# EAGLE design Single PCB - IRM-10-5 (EAGLE 9.6.2)
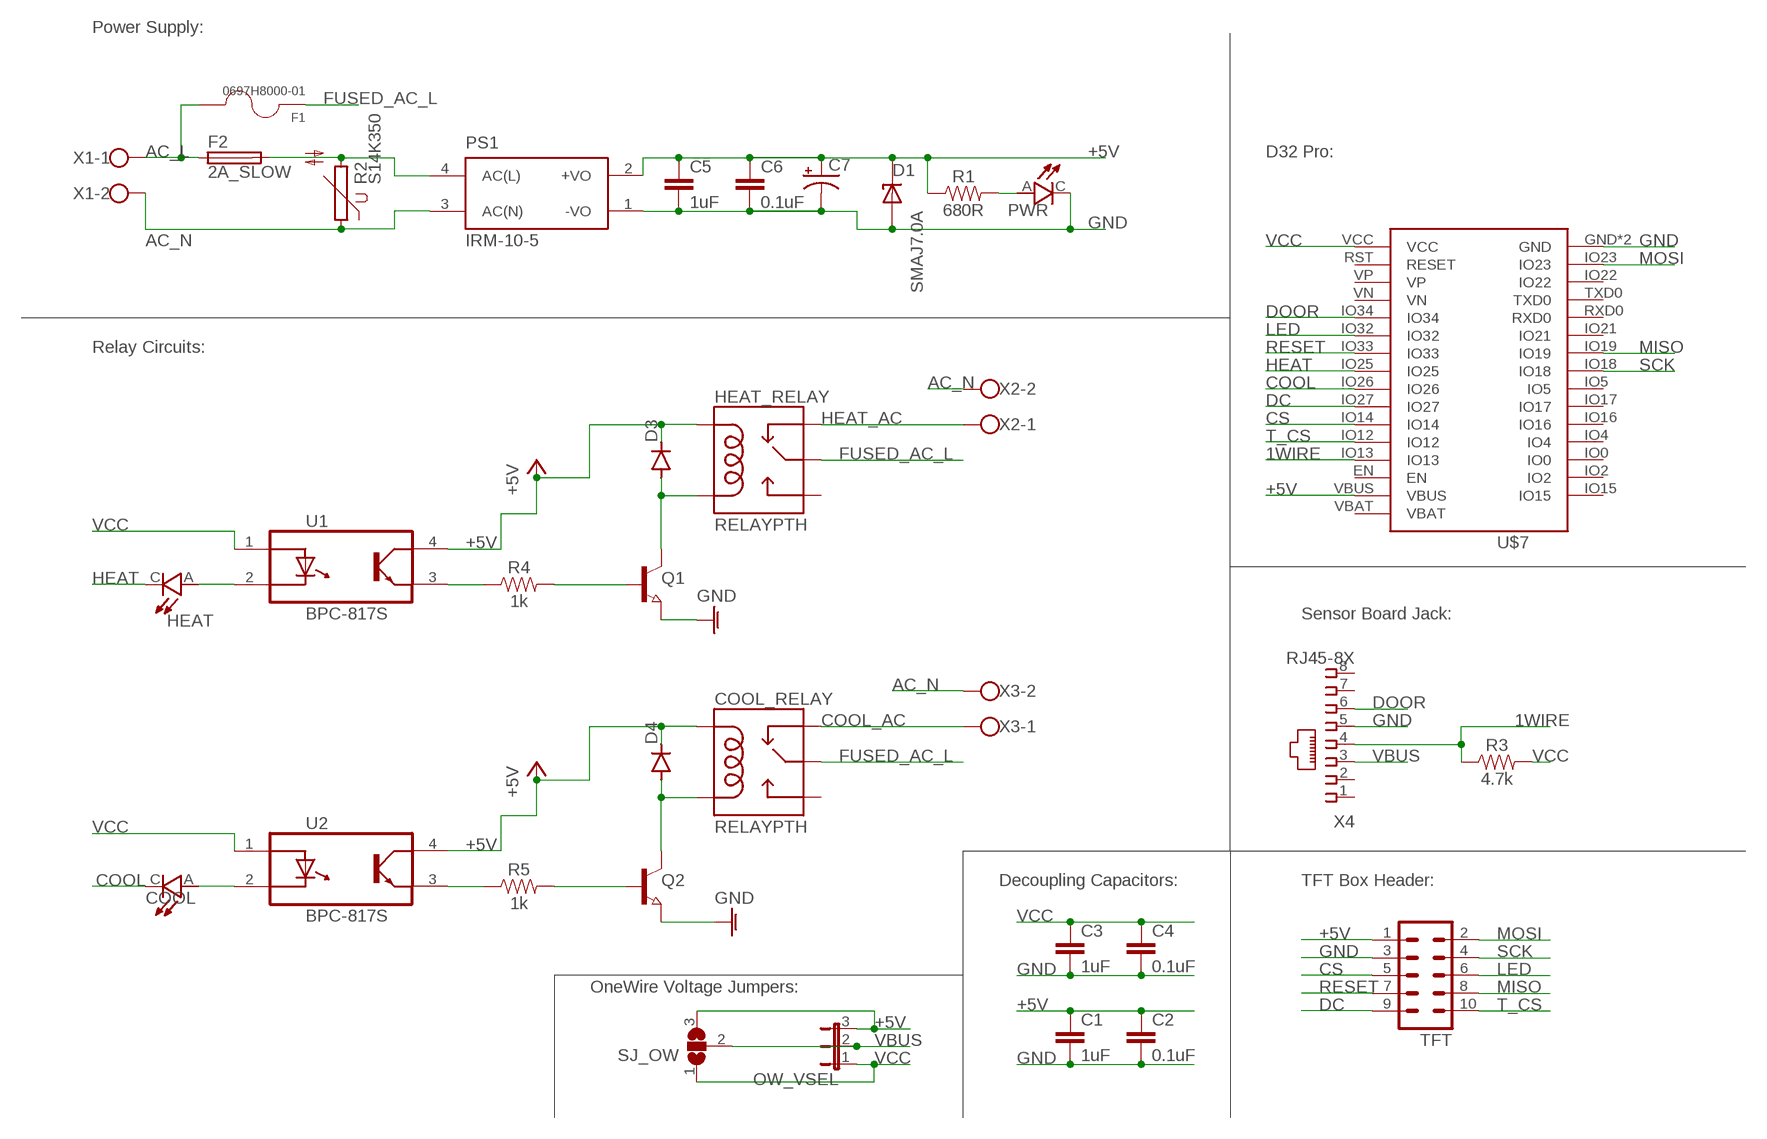
[diagram p0: schematic, sheet 1]

## Parts
C1  1uF  CAP_SMD0805  [SMD-0805]
C2  0.1uF  CAP_SMD0805  [SMD-0805]
C3  1uF  CAP_SMD0805  [SMD-0805]
C4  0.1uF  CAP_SMD0805  [SMD-0805]
C5  1uF  CAP_SMD0805  [SMD-0805]
C6  0.1uF  CAP_SMD0805  [SMD-0805]
C7  220uF  220UF-POLAR220UF  [CAPPRD750W80D1600H2700]
COOL  LED_0603LED_SMD_0603  [LED_SMD_0603]
COOL_RELAY  RELAYPTH  [SRD-05VDC-SL-C]
D1  SMAJ7.0A  [DIOM4325X250N]
D3  DIODE-DO214AC  [DO214AC]
D4  DIODE-DO214AC  [DO214AC]
F1  0697H8000-01  [FUSRR508W60L835T400H810]
F2  2A_SLOW  FUSEFUSE_85_43  [FUSE_BK/PCE-5-R]
HEAT  LED_0603LED_SMD_0603  [LED_SMD_0603]
HEAT_RELAY  RELAYPTH  [SRD-05VDC-SL-C]
OW_VSEL  JP2ENOLABEL  [JP2-NOLABEL]
PS1  IRM-10-5  IRM-10-5-JB  [IRM-10_MWU]
PWR  LED_0603LED_SMD_0603  [LED_SMD_0603]
Q1  NPN-TRANSISTOR_SOT23  [SOT23]
Q2  NPN-TRANSISTOR_SOT23  [SOT23]
R1  680R  RES_SMD0805  [SMD-0805]
R2  S14K350  S10K350  [S10K350]
R3  4.7k  RES_SMD0805  [SMD-0805]
R4  1k  RES_SMD0805  [SMD-0805]
R5  1k  RES_SMD0805  [SMD-0805]
SJ_OW  SJ2W  [SJ_2]
TFT  MA05-2  [MA05-2]
U1  BPC-817S  [SOIC127P700X210-4N]
U2  BPC-817S  [SOIC127P700X210-4N]
U$7  WEMOS-D32D32_PRO_NO-KEEPOUT  [D32_PRO_NO-KEEPOUT]
X1  W237-102  [W237-102]
X2  W237-102  [W237-102]
X3  W237-102  [W237-102]
X4  RJ45-8X  [RJ45-NO-SHIELD]

## Nets
1WIRE: R3.1 U$7.IO13 X4.4
+5V: C1.1 C2.1 C5.1 C6.1 C7.2(+) COOL_RELAY.COIL1 D1.C D3.C D4.C HEAT_RELAY.COIL1 OW_VSEL.3 PS1.2(+VO) R1.1 SJ_OW.3 TFT.1 U1.4(CO) U2.4(CO) U$7.VBUS
AC_L [AC]: F1.2 F2.1 X1.1
AC_N [AC]: PS1.3(AC(N)) R2.1 X1.2 X2.2 X3.2
COOL: COOL.C U$7.IO26
COOL_AC [AC]: COOL_RELAY.SWCLOSED(SWCLOSE) X3.1
CS: TFT.5 U$7.IO14
DC: TFT.9 U$7.IO27
DOOR: U$7.IO34 X4.6
FUSED_AC_L: COOL_RELAY.SWCOMMON F1.1 HEAT_RELAY.SWCOMMON
GND: C1.2 C2.2 C3.2 C4.2 C5.2 C6.2 C7.1(-) D1.A PS1.1(-VO) PWR.C Q1.2(E) Q2.2(E) TFT.3 U$7.GND U$7.GND2(GND) X4.5 ; supply symbol labelled GNDA
HEAT: HEAT.C U$7.IO25
HEAT_AC [AC]: HEAT_RELAY.SWCLOSED(SWCLOSE) X2.1
LED: TFT.6 U$7.IO32
MISO: TFT.8 U$7.IO19
MOSI: TFT.2 U$7.IO23
N$1: Q1.1(B) R4.2
N$2 [AC]: F2.2 PS1.4(AC(L)) R2.2
N$3: PWR.A R1.2
N$4: R4.1 U1.3(E)
N$5: COOL_RELAY.COIL0 D4.A Q2.3(C)
N$6: R5.1 U2.3(E)
N$7: Q2.1(B) R5.2
N$12: HEAT.A U1.2(C)
N$14: D3.A HEAT_RELAY.COIL0 Q1.3(C)
N$16: COOL.A U2.2(C)
RESET: TFT.7 U$7.IO33
SCK: TFT.4 U$7.IO18
T_CS: TFT.10 U$7.IO12
VBUS: OW_VSEL.2 SJ_OW.2 X4.3
VCC: C3.1 C4.1 OW_VSEL.1 R3.2 SJ_OW.1 U1.1(A) U2.1(A) U$7.VCC
Unconnected: COOL_RELAY.SWOPEN HEAT_RELAY.SWOPEN U$7.EN U$7.IO0 U$7.IO2 U$7.IO4 U$7.IO5 U$7.IO15 U$7.IO16 U$7.IO17 U$7.IO21 U$7.IO22 U$7.RST(RESET) U$7.RXD0 U$7.TXD0 U$7.VBAT U$7.VN U$7.VP X4.1 X4.2 X4.7 X4.8

## Notes on the sheet
- Power Supply:
- D32 Pro:
- Relay Circuits:
- Sensor Board Jack:
- Decoupling Capacitors: | TFT Box Header:
- OneWire Voltage Jumpers:

## Library data of the parts
C1 C3 C5 = Donnie:CAP_SMD; LCSC_PART: C28323
C2 C4 C6 = Donnie:CAP_SMD; LCSC_PART: C49678
C7 = Donnie:220UF-POLAR: 220µF polarized capacitors A capacitor is a passive two-terminal electrical component used to store electrical energy temporarily in an electric field. This is specifically a aluminum polymer capacitor available from DigiKey; LCSC_PART: C698141
COOL HEAT PWR = Donnie:LED_0603: RED CHIP LED MINI-MOLD Check availability <https://pricing.snapeda.com/parts/SML-D12U1WT86/Rohm/view-part?ref=eda>; DESCRIPTION: Red 620nm LED Indication - Discrete 2.2V 0603 (1608 Metric); LCSC_PART: C2286; PACKAGE: 0603 Rohm
COOL_RELAY HEAT_RELAY = SRD-05VDC-SL-C:RELAY: SPDT relay (COM-00101); JLC_X: -0.3; JLC_Y: -0.2; LCSC_PART: C35449
D1 = Donnie:SMAJ7.0A: Check availability <https://pricing.snapeda.com/parts/SMAJ7.0A/Littelfuse/view-part?ref=eda>; AVAILABILITY: In Stock; DESCRIPTION: 12V Clamp 33.3A Ipp Tvs Diode Surface Mount DO-214AC (SMA); LCSC_PART: C309904; MF: Littelfuse; MP: SMAJ7.0A; PACKAGE: DO-214 Littelfuse; PRICE: None; PURCHASE-URL: https://pricing.snapeda.com/search/part/SMAJ7.0A/?ref=eda
D3 D4 = diode:DIODE-: DIODE; LCSC_PART: C95872
F1 = Donnie:0697H8000-01: 2-Pin Radial Fuse | Rectangular | Slow Blow | UL | Bulk Pack | 250mA Check availability <https://pricing.snapeda.com/parts/0697H8000-01/Bel%20Fuse/view-part?ref=eda>; AVAILABILITY: In Stock; DESCRIPTION: 2-Pin Radial Fuse | Rectangular | Slow Blow | UL | Bulk Pack | 8A; LCSC_PART: C3157783; MF: Bel Fuse; MP: 0697H8000-01; PACKAGE: Radial Box Bel Fuse; PRICE: None; PURCHASE-URL: https://pricing.snapeda.com/search/part/0697H8000-01/?ref=eda
F2 = Donnie:FUSE: SS-5H-2A-APH Fuse Subminiature Slow Blow Acting 2A 300V Radial 8.5 X 4.3 X 7.85mm Plastic Ammo PSE/TUV/cULus; DIGIKEY: 283-4166-1-ND; LCSC_PART: C3161740; MANUF: SS-5H-2A-APH
OW_VSEL = Donnie:JP2E: JUMPER; LCSC_PART: C2937625
PS1 = Donnie:IRM-10-5-JB; JLC_R: 180; JLC_X: -23.15; JLC_Y: 9; LCSC_PART: C2857903
Q1 Q2 = semicon-smd-ipc:NPN-TRANSISTOR_: NPN TRANSISTOR; JLC_R: -90; LCSC_PART: C20526
R1 = Donnie:RES_SMD; LCSC_PART: C17798
R2 = Donnie:S10K350: VARISTOR; DIGIKEY: 495-76419-ND; JLC_R: 90; LCSC_PART: C78355
R3 = Donnie:RES_SMD; LCSC_PART: C17673
R4 R5 = Donnie:RES_SMD; LCSC_PART: C17513
SJ_OW = jumper:SJ2W: SMD solder JUMPER
TFT = Box Header:MA05-2: PIN HEADER; OC_FARNELL: unknown; OC_NEWARK: unknown
U1 U2 = Donnie:BPC-817S: Check availability <https://pricing.snapeda.com/parts/VOS618A-7X001T/Vishay/view-part?ref=eda>; LCSC_PART: C106900
U$7 = Donnie:WEMOS-D32: D32_REVERSE is a Reverse silkscreen for placing the Wemos D32 on the underside of the board D32_NO-KEEPOUT removes the keepout area beneath the antenna on the D32 and provides a note to avoid components and traces.; JLC_R: 90; JLC_X: 1.3; JLC_Y: -11.4; LCSC_PART: C18078137
X1-X3 = con-wago-500:W237-102: WAGO SCREW CLAMP; MPN: 237-102; OC_FARNELL: unknown; OC_NEWARK: 70K9898
X4 = Box Header:RJ45: CORCOM Modular RJ Jacks No Shield Source: www.tycoelectronics.com .. ENG_DS_1654001_1099_RJ_L_0507.pdf; JLC_Y: 7.55; LCSC_PART: C3000197; MPN: RJ45-8X; OC_FARNELL: unknown; OC_NEWARK: 16R6101

## Net classes
0 default: width 1.016 mm, clearance 0.254 mm
1 AC: width 2.54 mm, clearance 1.2 mm

## Board
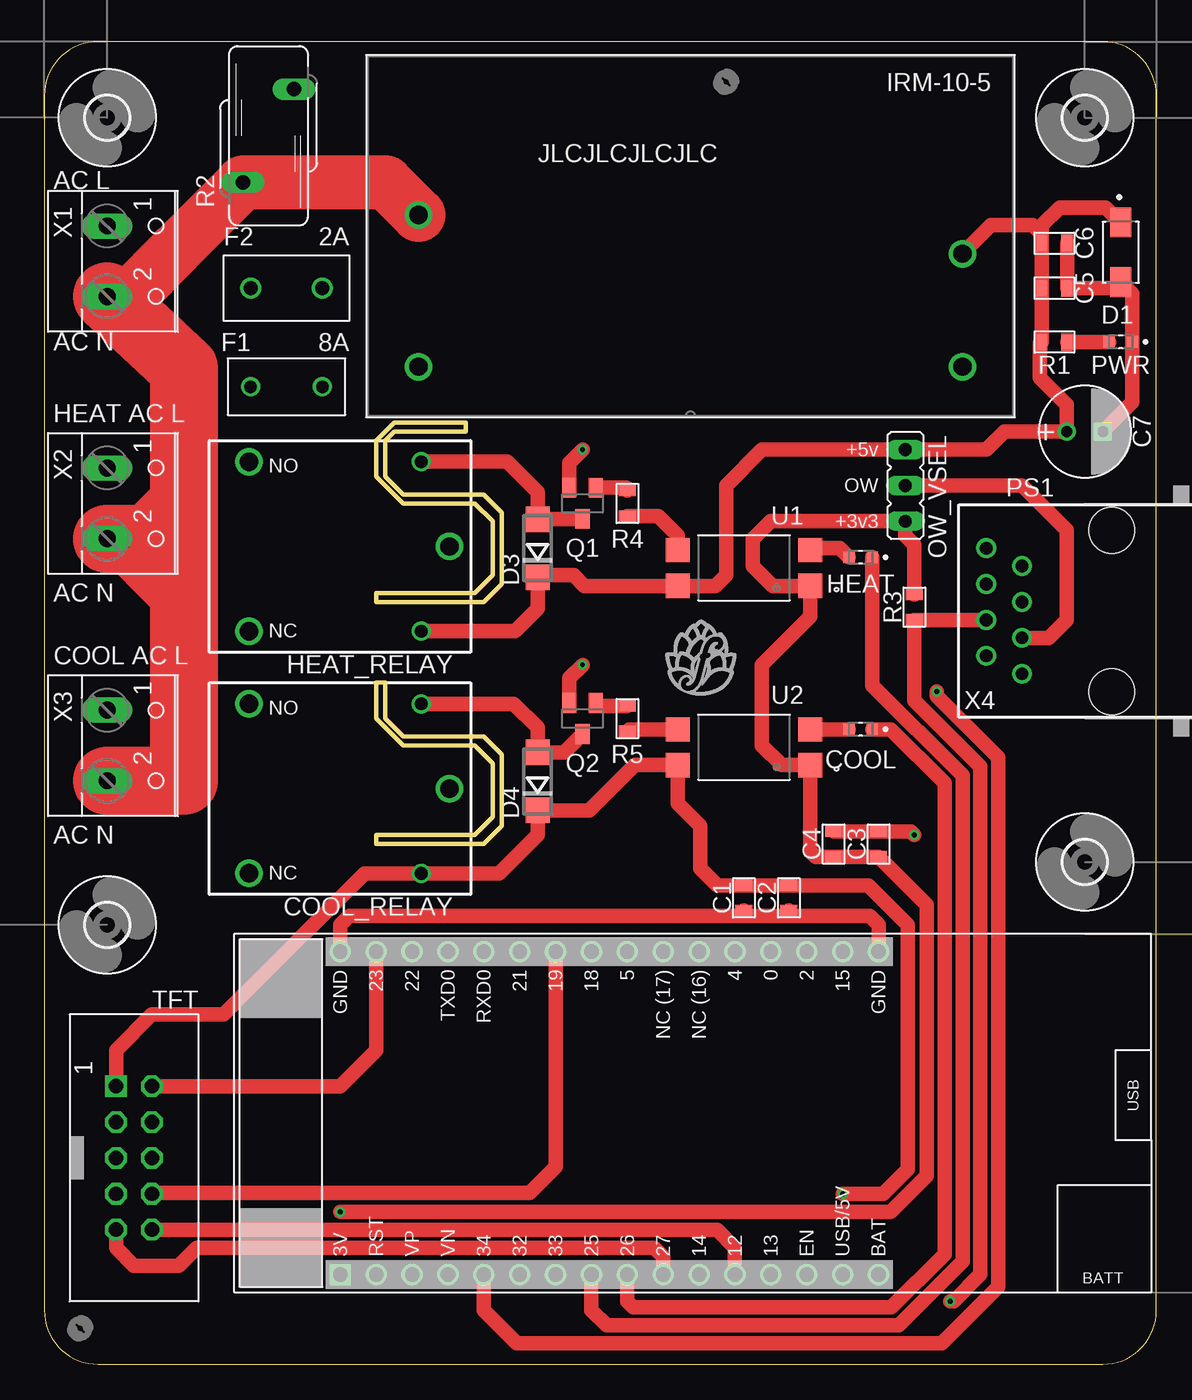
[diagram p1: board, top side]
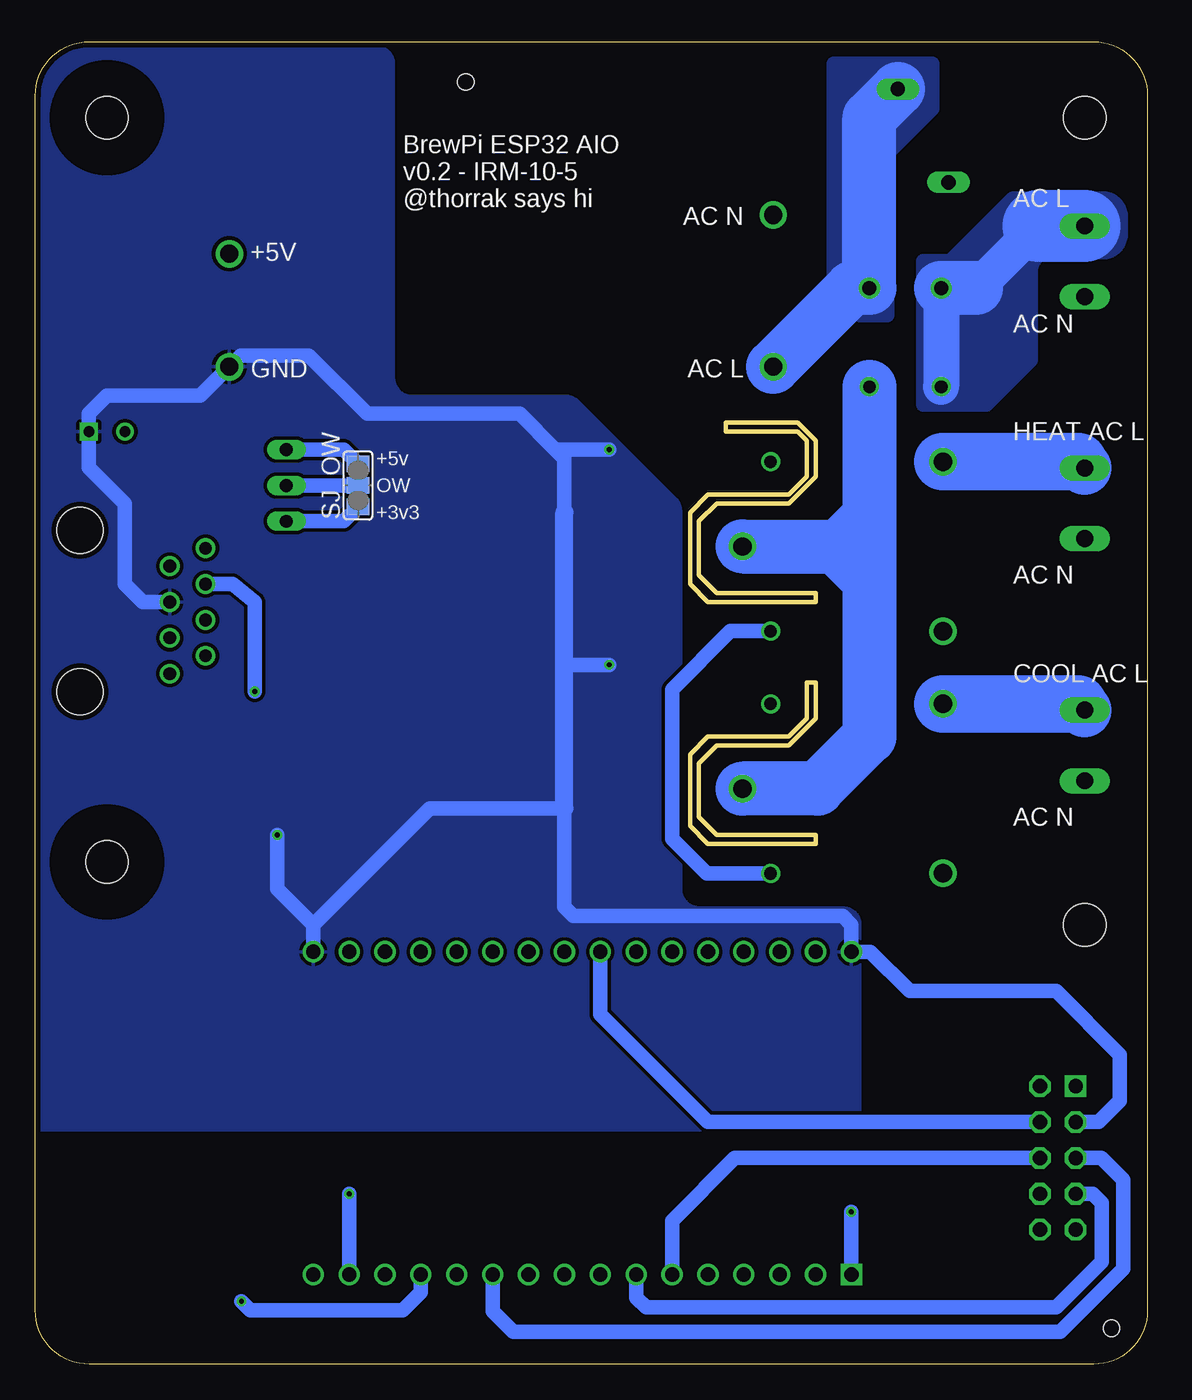
[diagram p2: board, bottom side, seen from below]

Size 78.73 x 93.65 mm. Coordinates in mm from the lower left corner, seen from the top.
Outline: 0,89.84 0,3.81 arc90 3.81,0 74.92,0 arc90 78.73,3.81 78.73,89.84 arc90 74.92,93.65 3.81,93.65 arc90 0,89.84
Outline: 24.13,65.41 24.13,62.87 25.4,61.59 31.11,61.59 32.38,60.32 32.38,55.24 31.11,53.98 23.5,53.98 23.5,54.61 30.48,54.61 31.75,55.88 31.75,59.69 30.48,60.96 25.4,60.96 23.5,62.87 23.5,65.41 24.77,66.68 29.84,66.68 29.84,66.04 24.77,66.04 24.13,65.41
Outline: 23.5,48.26 24.13,48.26 24.13,45.72 25.4,44.45 31.11,44.45 32.38,43.18 32.38,38.1 31.11,36.83 23.5,36.83 23.5,37.46 30.48,37.46 31.75,38.73 31.75,42.55 30.48,43.81 25.4,43.81 23.5,45.72 23.5,48.26
Copper layers (1*16): Top 0.0356mm / dielectric 1.5011mm / Bottom 0.0356mm
Design rules "PCBs_io": minimum track width 6mil, minimum drill 13mil, track to track 6mil, track to pad 6mil, pad to pad 6mil, via to via 6mil, smd to smd 6mil, copper to edge 15mil, drill to drill 6mil, minimum pad ring 7mil, minimum via ring 7mil, stop-mask expansion 3mil, vias tented up to drill 0mil, thermal gap 10mil

### Footprints (pad centres in the part's own frame; a part is rotated, then mirrored left to right if it is on the bottom)
SMD-0805 = smd 0.8 x 1.2: 1 -0.9,0; 2 0.9,0
CAPPRD750W80D1600H2700 = drill 0.75 pad 1.27 square: 1 -1.28,0 | drill 0.75 pad 1.27: 2 1.28,0
LED_SMD_0603 = smd 0.8 x 0.8: A 0.825,0; C -0.825,0
SRD-05VDC-SL-C = drill 0.9: COIL0 -5.39,-6.12; COIL1 -5.39,5.88 | drill 1.3: SWCLOSED 6.81,-6.12; SWCOMMON -7.39,-0.12; SWOPEN 6.81,5.88
DIOM4325X250N = smd 2.12 x 1.5: A 2.115,0; C -2.115,0
DO214AC = smd 1.8 x 1.7: A 2.05,0; C -2.05,0
FUSRR508W60L835T400H810 = drill 0.9 pad 1.35: 1 -2.54,0; 2 2.54,0
FUSE_BK/PCE-5-R = drill 1: 1 -2.54,0; 2 2.54,0
JP2-NOLABEL = drill 0.914 long: 1 -2.54,0; 2 0,0; 3 2.54,0
IRM-10_MWU = drill 1.295 pad 1.803: 1 3.81,-3.81; 2 3.81,-11.811; 3 42.316,-14.554; 4 42.316,-3.81
SOT23 = smd 1 x 1.4: 1 -0.95,-1.1; 2 0.95,-1.1; 3 0,1.1
S10K350 = drill 1.016 long: 1 -1.8,-3.3; 2 1.8,3.3
SJ_2 = smd 1.168 x 1.6: 1 -1.524,0; 2 0,0; 3 1.524,0
MA05-2 = drill 1.016 square: 1 -5.08,-1.27 | drill 1.016 octagon: 2 -5.08,1.27; 3 -2.54,-1.27; 4 -2.54,1.27; 5 0,-1.27; 6 0,1.27; 7 2.54,-1.27; 8 2.54,1.27; 9 5.08,-1.27; 10 5.08,1.27
SOIC127P700X210-4N = smd 1.68 x 1.71: 1 -4.692,1.27; 2 -4.692,-1.27; 3 4.692,-1.27; 4 4.692,1.27
3,0 = hole 3: 0,0
1.152 = hole 1.152: 0,0
D32_PRO_NO-KEEPOUT = drill 1: EN -11.43,-12.7; GND 11.43,20.32; GND2 11.43,-17.78; IO0 11.43,-10.16; IO2 11.43,-12.7; IO4 11.43,-7.62; IO5 11.43,0; IO12 -11.43,-7.62; IO13 -11.43,-10.16; IO14 -11.43,-5.08; IO15 11.43,-15.24; IO16 11.43,-5.08; IO17 11.43,-2.54; IO18 11.43,2.54; IO19 11.43,5.08; IO21 11.43,7.62; IO22 11.43,15.24; IO23 11.43,17.78; IO25 -11.43,2.54; IO26 -11.43,0; IO27 -11.43,-2.54; IO32 -11.43,7.62; IO33 -11.43,5.08; IO34 -11.43,10.16; RST -11.43,17.78; RXD0 11.43,10.16; TXD0 11.43,12.7; VBAT -11.43,-17.78; VBUS -11.43,-15.24; VN -11.43,12.7; VP -11.43,15.24 | drill 1 square: VCC -11.43,20.32
W237-102 = drill 1.194 long: 1 -2.5,-1.27; 2 2.5,-1.27
RJ45-NO-SHIELD = drill 0.9 pad 1.4: 1 -4.445,6.35; 2 -3.175,8.89; 3 -1.905,6.35; 4 -0.635,8.89; 5 0.635,6.35; 6 1.905,8.89; 7 3.175,6.35; 8 4.445,8.89 | hole 3.251: -5.715,0; 5.715,0

### Placement (x,y rotation side)
C1  49.53,33.02 270 top
C2  52.7,33.02 270 top
C3  59.05,36.83 90 top
C4  55.88,36.83 90 top
C5  71.5,76.2 0 top
C6  71.5,79.38 0 top
C7  73.66,66.04 180 top
COOL  57.78,44.96 180 top
COOL_RELAY  21.29,40.64 180 top
D1  76.2,78.74 270 top
D3  34.92,57.79 90 top
D4  34.92,41.27 90 top
F1  17.14,69.22 180 top
F2  17.14,76.2 0 top
HEAT  57.78,57.15 180 top
HEAT_RELAY  21.29,57.79 180 top
OW_VSEL  60.96,62.23 90 top
PS1  68.81,66.83 180 top
PWR  76.2,72.39 180 top
Q1  38.1,60.96 180 top
Q2  38.1,45.72 180 top
R1  71.5,72.39 0 top
R2  15.88,87 0 top
R3  61.59,53.61 90 top
R4  41.27,60.96 90 top
R5  41.27,45.72 90 top
SJ_OW  55.88,62.23 90 bottom
TFT  6.35,14.6 270 top
U1  49.53,56.39 180 top
U2  49.53,43.69 180 top
U$1  [3,0]  4.45,88.27 0 top
U$2  [3,0]  4.45,31.12 0 top
U$3  [3,0]  73.66,35.56 0 top
U$4  [3,0]  73.66,88.27 0 top
U$5  [1.152]  2.54,2.54 0 top
U$6  [1.152]  48.26,90.81 0 top
U$7  41.27,17.78 90 top
X1  5.71,78.11 270 top
X2  5.71,60.96 270 top
X3  5.71,43.81 270 top
X4  75.56,53.34 90 top

### Tracks (layer width: path | path; a pad name or v marks a point on that pad's centre or on a via)
1WIRE  (via drill 0.35)
  Top 1.016: v64.14,4.45 64.37,4.45 66.27,6.35 66.27,42.31 61.59,46.99 R3.1 64.77,52.71 X4.4
  Bottom 1.016: v64.14,4.45 63.5,3.81 52.7,3.81 51.43,5.08 U$7.IO13
+5V  (via drill 0.35)
  Top 1.016: HEAT_RELAY.COIL1 33.33,51.91 34.92,53.5 D3.C 35.07,55.88 37.46,55.88 38.23,55.12 U1.4 47.5,55.12 48.26,55.88 48.26,62.23 50.8,64.77 OW_VSEL.3 66.67,64.77 67.95,66.04 C7.2 72.38,67.96 70.48,69.85 70.48,72.27 R1.1 C5.1 C6.1 | v56.51,12.06 59.39,12.06 61.13,13.8 61.13,31.12 58.32,33.92 C2.1 C1.1 47.62,33.92 46.45,35.1 46.45,38.1 44.84,39.71 U2.4 41.78,42.42 38.59,39.23 D4.C 34.92,37.46 32.22,34.76 COOL_RELAY.COIL1 22.7,34.76 12.7,24.77 7.62,24.77 5.08,22.23 TFT.1 | PS1.2 67.01,80.65 69.97,80.65 70.6,80.01 C6.1 | C6.1 70.6,80.65 71.87,81.92 75.14,81.92 D1.C
  Bottom 1.016: HEAT_RELAY.COIL1 29.52,51.91 33.65,47.77 33.65,37.21 31.2,34.76 COOL_RELAY.COIL1 | U$7.VBUS v56.51,12.06 | SJ_OW.3 56.9,64.77 OW_VSEL.3
AC_L
  Bottom 2.54: F2.1 F1.2 | 7.73,80.61 12.13,76.2
  Bottom 3.81: 12.13,76.2 F2.1
  Bottom 5.08: X1.1 7.73,80.61
  pour Bottom: 6.99,78.74 3.18,78.74 arc-90 1.9,80.01 1.9,81.28 arc-90 3.18,82.55 9.53,82.55 13.97,78.11 15.88,78.11 15.88,67.95 11.43,67.95 8.26,71.12 8.26,77.47 arc90
AC_N
  Top 2.54: 9.89,53.98 8.93,53.98 X2.2 5.76,58.46 8.89,61.59 9.89,61.59
  Top 3.81: 8.21,58.46 9.89,57.15 | X1.2 6,75.61 9.34,78.95 9.34,78.96 R2.1 24.18,83.7 PS1.3
  Top 4.826: X3.2 9.89,41.31 9.89,53.98 9.89,57.15 9.89,61.59 9.89,70.53 X1.2 | X2.2 8.21,58.46
COOL
  Top 1.016: U$7.IO26 41.27,4.45 41.7,4.02 59.95,4.02 63.73,7.8 63.73,41.15 59.93,44.96 COOL.C
COOL_AC
  Bottom 3.81: X3.1 4.89,46.76
  Bottom 4.064: COOL_RELAY.SWCLOSED 4.89,46.76
CS
  Bottom 1.016: TFT.5 3.28,14.6 1.73,13.06 1.73,6.75 6.19,2.29 44.9,2.29 46.35,3.74 U$7.IO14
DC
  Top 1.016: TFT.9 5.08,8.26 6.35,6.99 9.53,6.99 10.79,8.26 43.18,8.26 43.81,7.62 U$7.IO27
DOOR  (via drill 0.35)
  Top 1.016: v63.18,47.62 63.18,47.31 67.54,42.95 67.54,5.47 63.54,1.48 33.45,1.48 31.11,3.81 U$7.IO34
  Bottom 1.016: X4.6 64.77,55.24 63.18,53.98 v63.18,47.62
FUSED_AC_L
  Bottom 2.54: 19.68,60.96 22.74,57.9 HEAT_RELAY.SWCOMMON 22.98,57.9 20.32,55.24 | 21.71,57.9 19.68,55.88
  Bottom 3.81: F1.1 19.68,60.96 19.68,55.88 19.68,44.45 23.38,40.76 COOL_RELAY.SWCOMMON | HEAT_RELAY.SWCOMMON 21.71,57.9
GND  (via drill 0.35)
  Top 1.016: U$7.GND 20.96,31.12 21.59,31.75 49.16,31.75 | 49.16,31.75 52.7,31.75 | 52.7,31.75 58.42,31.75 59.05,31.12 U$7.GND2 | C4.2 C3.2 61.33,37.73 v61.59,37.46 | C1.2 49.16,31.75 | C2.2 52.7,31.75 | Q1.2 37.15,63.82 v38.1,64.77 | Q2.2 37.15,48.58 v38.1,49.53 | C6.2 C5.2 75.78,76.2 D1.A 77.03,75.8 PWR.C 77.03,68.12 C7.1
  Bottom 1.016: 41.27,60.32 41.27,64.14 41.91,64.77 | X4.5 71.12,53.98 72.39,55.24 72.39,60.95 74.94,63.5 C7.1 74.94,67.31 73.67,68.58 67.06,68.58 PS1.1 64.2,71.43 59.37,71.43 55.24,67.31 44.45,67.31 41.91,64.77 | TFT.3 3.44,17.17 1.96,18.65 1.96,21.92 6.46,26.42 16.82,26.42 19.62,29.21 U$7.GND 20.96,31.12 21.59,31.75 40.64,31.75 41.27,32.38 41.27,39.37 50.8,39.37 59.05,31.12 | 59.05,31.12 U$7.GND2 | v61.59,37.46 61.59,33.66 59.05,31.12 | v38.1,64.77 41.91,64.77 | v38.1,49.53 41.27,49.53
  Bottom 1.27: 41.27,39.37 41.27,49.53 41.27,60.32
  pour Bottom: 78.74,93.34 54.61,93.34 arc90 53.34,92.08 53.34,69.85 arc-90 52.07,68.58 41.17,68.58 arc45 40.27,68.21 33.39,61.33 arc45 33.02,60.43 33.02,33.66 arc-90 31.75,32.38 21.59,32.38 arc90 20.32,31.12 20.32,16.51 78.74,16.51
HEAT
  Top 1.016: U$7.IO25 38.73,3.81 39.8,2.75 60.47,2.75 65,7.27 65,41.68 58.61,48.07 HEAT.C
HEAT_AC
  Bottom 3.81: 4.89,63.93 X2.1
  Bottom 4.064: HEAT_RELAY.SWCLOSED 4.89,63.93
LED
  Bottom 1.016: U$7.IO32 33.65,10.16 29.21,14.6 TFT.6
MISO
  Top 1.016: TFT.8 7.73,12.15 34.38,12.15 36.2,13.97 36.2,19.69 U$7.IO19
MOSI
  Top 1.016: TFT.2 20.96,19.69 23.5,22.23 U$7.IO23
N$1
  Top 1.016: R4.2 41.18,62.06 Q1.1
N$2
  Bottom 3.81: PS1.4 20.93,76.2 F2.2 19.68,88.29 R2.2
  pour Bottom: 15.24,92.08 22.23,92.08 22.23,76.2 20.32,74.3 18.41,74.3 18.41,85.73 15.24,88.9
N$3
  Top 1.016: PWR.A R1.2
N$4
  Top 1.016: U1.3 44.84,58.67 43.45,60.06 R4.1
N$5
  Top 1.016: COOL_RELAY.COIL0 33.25,46.76 34.92,45.09 D4.A 36.8,43.32 Q2.3
N$6
  Top 1.016: U2.3 41.41,44.96 R5.1
N$7
  Top 1.016: R5.2 39.25,46.62 Q2.1
N$12
  Top 1.016: HEAT.A 56.32,57.79 54.35,57.79 U1.2
N$14
  Top 1.016: HEAT_RELAY.COIL0 32.78,63.9 34.92,61.76 D3.A 35.07,59.69 35.24,59.86 Q1.3
N$16
  Top 1.016: COOL.A U2.2
RESET
  Bottom 1.016: U$7.IO33 36.2,4.71 35.5,4.02 6.46,4.02 3.23,7.25 3.23,11.42 3.87,12.06 TFT.7
SCK
  Bottom 1.016: U$7.IO18 38.73,24.77 31.11,17.15 TFT.4
T_CS
  Top 1.016: U$7.IO12 48.89,8.26 47.62,9.53 TFT.10
VBUS
  Top 1.016: OW_VSEL.2 69.22,62.23 72.39,59.05 72.39,52.7 71.12,51.43 X4.3
  Bottom 1.016: SJ_OW.2 OW_VSEL.2
VCC  (via drill 0.35)
  Top 1.016: R3.2 61.59,58.05 60.96,58.68 OW_VSEL.1 51.43,59.69 50.16,58.42 50.16,56.52 51.56,55.12 U1.1 54.22,52.95 50.8,49.53 50.8,43.81 52.2,42.42 U2.1 54.22,36.32 54.61,35.93 C4.1 C3.1 62.46,32.52 62.46,13.33 59.92,10.79 v20.96,10.79
  Bottom 1.016: v20.96,10.79 U$7.VCC | SJ_OW.1 56.9,59.69 OW_VSEL.1

### Text on the board
tPlace: AC L | AC N | HEAT AC L | NO | AC N | NC | COOL AC L | NO | AC N | NC
bPlace: AC L | AC N | +5V | AC N | AC L | GND | HEAT AC L | AC N | COOL AC L | AC N
tNames: JLCJLCJLCJLC | 2A | 8A | +5v | OW | +3v3
bNames: BrewPi ESP32 AIO / v0.2 - IRM-10-5 / @thorrak says hi | +5v | OW | +3v3